# Altium schematic sheet CANbus.SchDoc
size A; SheetNumber: 11; SheetTotal: 11
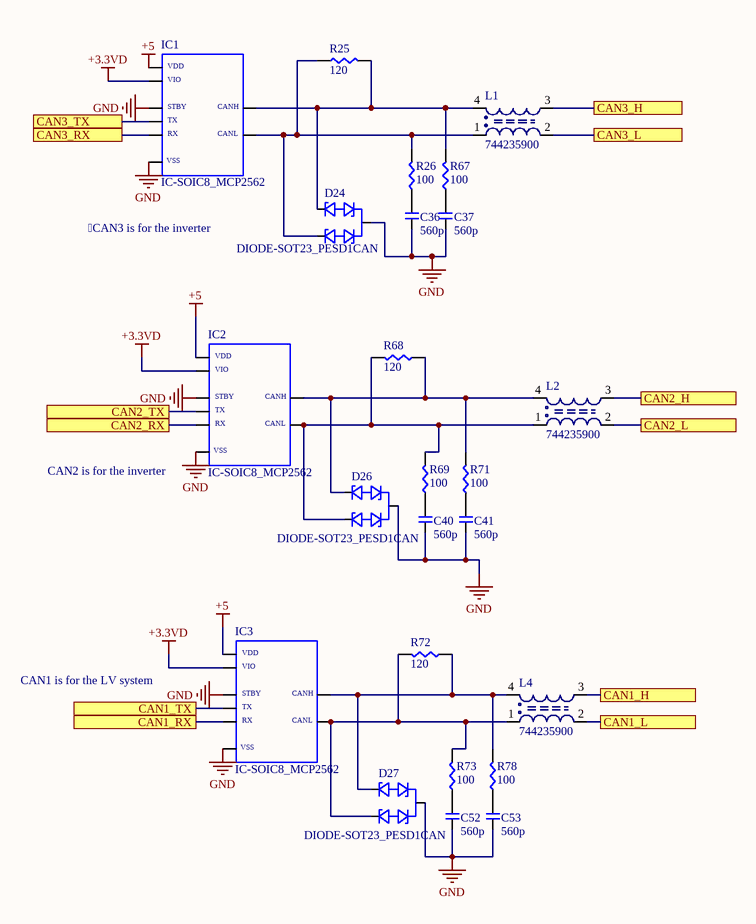
[diagram p0: CANbus.SchDoc]

## Parts
C36  560p  [CAP-0603]
C37  560p  [CAP-0603]
C40  560p  [CAP-0603]
C41  560p  [CAP-0603]
C52  560p  [CAP-0603]
C53  560p  [CAP-0603]
D24  DIODE-SOT23_PESD1CAN  [SOT23]
D26  DIODE-SOT23_PESD1CAN  [SOT23]
D27  DIODE-SOT23_PESD1CAN  [SOT23]
IC1  IC-SOIC8_MCP2562  [SOIC8]
IC2  IC-SOIC8_MCP2562  [SOIC8]
IC3  IC-SOIC8_MCP2562  [SOIC8]
L1  744235900  [WE-CNSW 1812]
L2  744235900  [WE-CNSW 1812]
L4  744235900  [WE-CNSW 1812]
R25  120  [RES-0603]
R26  100  [RES-0603]
R67  100  [RES-0603]
R68  120  [RES-0603]
R69  100  [RES-0603]
R71  100  [RES-0603]
R72  120  [RES-0603]
R73  100  [RES-0603]
R78  100  [RES-0603]

## Ports
CAN1_H, CAN1_L, CAN1_RX, CAN1_TX, CAN2_H, CAN2_L, CAN2_RX, CAN2_TX, CAN3_H, CAN3_L, CAN3_RX, CAN3_TX

## Nets
+3.3VD: IC1.5 IC2.5 IC3.5
+5: IC1.3 IC2.3 IC3.3
GND: C36.1 C37.2 C40.1 C41.1 C52.1 C53.1 D24.3(G) D26.3(G) D27.3(G) IC1.2 IC1.8 IC2.2 IC2.8 IC3.2 IC3.8
CAN1_H: L4.3 ; port CAN1_H
CAN1_L: L4.2 ; port CAN1_L
CAN1_RX: IC3.4 ; port CAN1_RX
CAN1_TX: IC3.1 ; port CAN1_TX
CAN2_H: L2.3 ; port CAN2_H
CAN2_L: L2.2 ; port CAN2_L
CAN2_RX: IC2.4 ; port CAN2_RX
CAN2_TX: IC2.1 ; port CAN2_TX
CAN3_H: L1.3 ; port CAN3_H
CAN3_L: L1.2 ; port CAN3_L
CAN3_RX: IC1.4 ; port CAN3_RX
CAN3_TX: IC1.1 ; port CAN3_TX
NetC36_2: C36.2 R26.1
NetC37_1: C37.1 R67.1
NetC40_2: C40.2 R69.1
NetC41_2: C41.2 R71.1
NetC52_2: C52.2 R73.1
NetC53_2: C53.2 R78.1
NetD24_1: D24.1(CAN1) IC1.7 L1.4 R25.2 R67.2
NetD24_2: D24.2(CAN2) IC1.6 L1.1 R25.1 R26.2
NetD26_1: D26.1(CAN1) IC2.7 L2.4 R68.1 R71.2
NetD26_2: D26.2(CAN2) IC2.6 L2.1 R68.2 R69.2
NetD27_1: D27.1(CAN1) IC3.7 L4.4 R72.1 R78.2
NetD27_2: D27.2(CAN2) IC3.6 L4.1 R72.2 R73.2

## Notes on the sheet
- CAN3 is for the inverter
- (near IC2) CAN2 is for the inverter
- CAN1 is for the LV system
- (in symbol IC-SOIC8_MCP2562) VDD; VIO; STBY; CANH; TX; RX; CANL; VSS

## Library data of the parts
C36 C37 C40 C41 C52 C53 = CAP-0603
L1 L2 L4 = CMP-1372-00007-1: SMD Shielded Coupled Inductor WE-CNSW, Z=90 Ohm; Manufacturer: Wuerth Elektronik; Impedance: 90 Ohm; PartNumber: 744235900; ComponentLink1URL: http://www.we-online.com; ComponentLink1Description: Manufacturer URL; ComponentLink2Description: Datasheet; PackageReference: WE-CNSW 1812; ComponentLink2URL: http://katalog.we-online.de/pbs/datasheet/744235900.pdf
R25 R26 R67-R69 R71-R73 R78 = RES-0603